# Altium schematic sheet CanRs232.SchDoc
size A; SheetNumber: 0; SheetTotal: 0
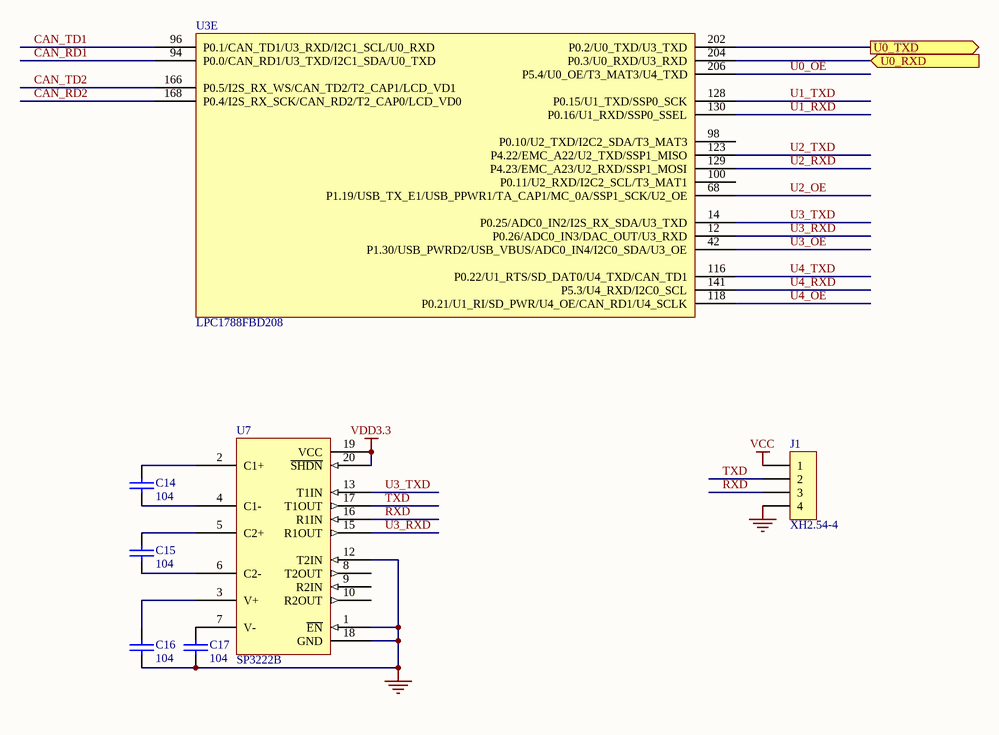
[diagram p0: CanRs232.SchDoc]

## Parts
C14  104  [C1206]
C15  104  [C1206]
C16  104  [C1206]
C17  104  [C1206]
J1  XH2.54-4  [A2501WF-04A]
U3  LPC1788FBD208  [QFP208]  (part E of 8)
U7  SP3222B  [TSSOP20]

## Ports
U0_RXD (in), U0_TXD (out)

## Nets
GND: C16.2 C17.2 J1.4 U7.1(~{EN}) U7.12(T2IN) U7.18(GND)
NC: U7.11(NC) U7.14(NC)
VCC: J1.1
VDD3.3: U7.19(VCC) U7.20(~{SHDN})
CAN_RD1: U3.94(P0.0/CAN_RD1/U3_TXD/I2C1_SDA/U0_TXD)
CAN_RD2: U3.168(P0.4/I2S_RX_SCK/CAN_RD2/T2_CAP0/LCD_VD0)
CAN_TD1: U3.96(P0.1/CAN_TD1/U3_RXD/I2C1_SCL/U0_RXD)
CAN_TD2: U3.166(P0.5/I2S_RX_WS/CAN_TD2/T2_CAP1/LCD_VD1)
RXD: J1.3 U7.16(R1IN)
TXD: J1.2 U7.17(T1OUT)
U0_OE: U3.206(P5.4/U0_OE/T3_MAT3/U4_TXD)
U0_RXD: U3.204(P0.3/U0_RXD/U3_RXD) ; port U0_RXD
U0_TXD: U3.202(P0.2/U0_TXD/U3_TXD) ; port U0_TXD
U1_RXD: U3.130(P0.16/U1_RXD/SSP0_SSEL)
U1_TXD: U3.128(P0.15/U1_TXD/SSP0_SCK)
U2_OE: U3.68(P1.19/USB_TX_E1/USB_PPWR1/TA_CAP1/MC_0A/SSP1_SCK/U2_OE)
U2_RXD: U3.129(P4.23/EMC_A23/U2_RXD/SSP1_MOSI)
U2_TXD: U3.123(P4.22/EMC_A22/U2_TXD/SSP1_MISO)
U3_OE: U3.42(P1.30/USB_PWRD2/USB_VBUS/ADC0_IN4/I2C0_SDA/U3_OE)
U3_RXD: U3.12(P0.26/ADC0_IN3/DAC_OUT/U3_RXD) U7.15(R1OUT)
U3_TXD: U3.14(P0.25/ADC0_IN2/I2S_RX_SDA/U3_TXD) U7.13(T1IN)
U4_OE: U3.118(P0.21/U1_RI/SD_PWR/U4_OE/CAN_RD1/U4_SCLK)
U4_RXD: U3.141(P5.3/U4_RXD/I2C0_SCL)
U4_TXD: U3.116(P0.22/U1_RTS/SD_DAT0/U4_TXD/CAN_TD1)
NetC14_1: C14.1 U7.2(C1+)
NetC14_2: C14.2 U7.4(C1-)
NetC15_1: C15.1 U7.5(C2+)
NetC15_2: C15.2 U7.6(C2-)
NetC16_1: C16.1 U7.3(V+)
NetC17_1: C17.1 U7.7(V-)

Not connected (* = marked no-connect by the designer): U3 98(P0.10/U2_TXD/I2C2_SDA/T3_MAT3) 100(P0.11/U2_RXD/I2C2_SCL/T3_MAT1); U7 8(T2OUT) 9(R2IN) 10(R2OUT)

## Library data of the parts
C14-C17 = CAP
J1 = XH2.54-4-SMD